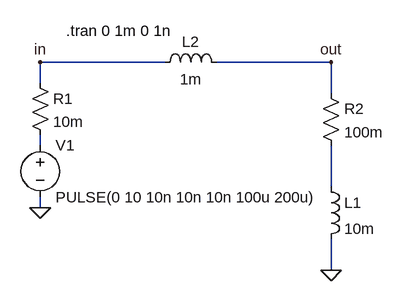
[diagram p0: schematic Step L.asc]
Step L.asc, the LTspice schematic file:
Version 4
SHEET 1 880 680
WIRE 208 0 16 0
WIRE 464 0 288 0
WIRE 16 32 16 0
WIRE 464 48 464 0
WIRE 16 128 16 112
WIRE 464 192 464 128
WIRE 16 224 16 208
WIRE 464 320 464 272
FLAG 464 320 0
FLAG 464 0 out
FLAG 16 0 in
FLAG 16 224 0
SYMBOL voltage 16 112 R0
WINDOW 123 0 0 Left 0
WINDOW 39 24 124 Left 2
SYMATTR InstName V1
SYMATTR Value PULSE(0 10 10n 10n 10n 100u 200u)
SYMBOL res 0 16 R0
SYMATTR InstName R1
SYMATTR Value 10m
SYMBOL res 448 32 R0
SYMATTR InstName R2
SYMATTR Value 100m
SYMBOL ind 448 176 R0
SYMATTR InstName L1
SYMATTR Value 10m
SYMBOL ind 192 16 R270
WINDOW 0 32 56 VTop 2
WINDOW 3 5 56 VBottom 2
SYMATTR InstName L2
SYMATTR Value 1m
SYMATTR SpiceLine Rser=10m Cpar=10f
TEXT 56 -48 Left 2 !.tran 0 1m 0 1n

The netlist it stands for:
* Step L.asc
V1 N001 0 PULSE(0 10 10n 10n 10n 100u 200u)
R1 in N001 10m
R2 out N002 100m
L1 N002 0 10m
L2 in out 1m Rser=10m Cpar=10f
.tran 0 1m 0 1n
.backanno
.end